# EAGLE schematic SensorCircuits1 (EAGLE 6.5.0)
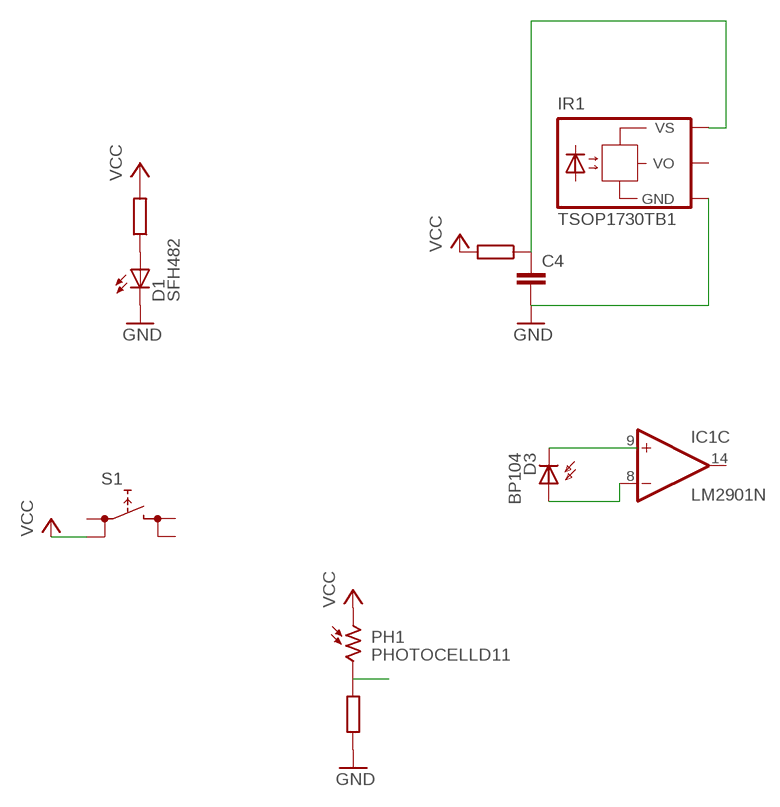
[diagram p0: schematic, sheet 1]

## Parts
C4  C2,5-3  [C2.5-3]
D1  SFH482  [SFH482]
D3  BP104  [BP104]
IC1  LM2901N  [DIL14]
IR1  TSOP1730TB1  [TSOP17_TB1]
PH1  PHOTOCELLD11  [D11XX_H]
S1  REKN  [REKN]

## Nets
GND: C4.2 D1.K(C) IR1.GND
N$1: C4.1 IR1.VS
N$2: D3.K(C)
N$3: D3.A IC1.8(C:-IN)
VCC: PH1.1 S1.0B
Unconnected: D1.A IC1.1(B:OUT) IC1.2(A:OUT) IC1.4(A:-IN) IC1.5(A:+IN) IC1.6(B:-IN) IC1.7(B:+IN) IC1.9(C:+IN) IC1.10(D:-IN) IC1.11(D:+IN) IC1.13(D:OUT) IC1.14(C:OUT) IR1.VO PH1.2 S1.0A S1.1A S1.1B

## Power pins joined to a net without a drawn wire
V+: IC1.3(P:V+)
V-: IC1.12(P:V-)

## Library data of the parts
C4 = capacitor-wima:C: CAPACITOR naming: grid - package width
D1 = led:SFH482: IR LED infrared emitting diode, Infineon
D3 = opto-trans-siemens:BP104: PHOTO DIODE; MF: VISHAY/TELEFUNKEN; MPN: BP104; OC_FARNELL: 1779636; OC_NEWARK: 14M4504
IC1 = linear:LM2901: COMPARATOR
IR1 = telefunken:TSOP17*TB1: TSOP17..TB1 IR Receiver Modules for Remote Control Systems Source: http://www.vishay.com/docs/82042/82042.pdf; OC_FARNELL: unknown; OC_NEWARK: unknown
PH1 = photo-elements:PHOTOCELL: Photo Sensor
S1 = switch:REKN: PUSH SWITCH ITT-Cannon-Cannon